# EAGLE schematic pushNotification (EAGLE 7.4.0)
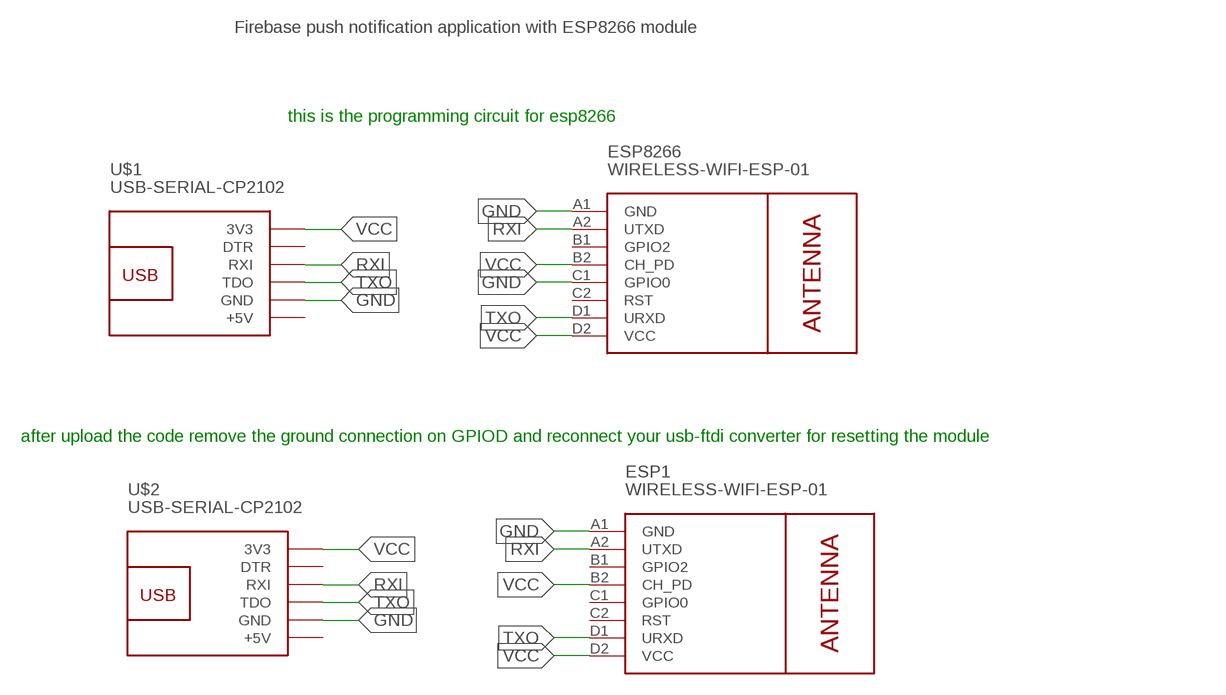
[diagram p0: schematic, sheet 1]

## Parts
ESP1  WIRELESS-WIFI-ESP-01  [WIRELESS-WIFI-ESP-01]
ESP8266  WIRELESS-WIFI-ESP-01  [WIRELESS-WIFI-ESP-01]
U$1  USB-SERIAL-CP2102  [USB-SERIAL-CP2102]
U$2  USB-SERIAL-CP2102  [USB-SERIAL-CP2102]

## Nets
GND: ESP1.A1(GND) ESP8266.A1(GND) ESP8266.C1(GPIO0) U$1.5(GND) U$2.5(GND)
RXI: ESP1.A2(UTXD) ESP8266.A2(UTXD) U$1.3(RXI) U$2.3(RXI)
TXO: ESP1.D1(URXD) ESP8266.D1(URXD) U$1.4(TDO) U$2.4(TDO)
VCC: ESP1.B2(CH_PD) ESP1.D2(VCC) ESP8266.B2(CH_PD) ESP8266.D2(VCC) U$1.1(3V3) U$2.1(3V3)
Unconnected: ESP1.B1(GPIO2) ESP1.C1(GPIO0) ESP1.C2(RST) ESP8266.B1(GPIO2) ESP8266.C2(RST) U$1.2(DTR) U$2.2(DTR)

## Notes on the sheet
- Firebase push notification application with ESP8266 module
- this is the programming circuit for esp8266
- after upload the code remove the ground connection on GPIOD and reconnect your usb-ftdi converter for resetting the module

## Power pins joined to a net without a drawn wire
+5V: U$1.6(+5V) U$2.6(+5V)

## Library data of the parts
ESP1 ESP8266 = diy-modules:WIRELESS-WIFI-ESP-01: Wireless Wi-Fi ESP-01 Module based on ESP8266 chip Click here to find device on ebay.com <http://www.ebay.com/sch/esp8266+esp+01+transceiver>
U$1 U$2 = diy-modules:USB-SERIAL-CP2102: USB to Serial UART Converter based on CP2102 chip More information about CP2102 chip is available here: https://www.silabs.com/documents/public/data-sheets/CP2102-9.pdf Drivers for CP210x devices are available here: http://www.silabs.com/products/development-tools/software/usb-to-uart-bridge-vcp-drivers Click here to find device on ebay.com <http://www.ebay.com/sch/cp2102+micro+usb>